# EAGLE design vfd-driver (EAGLE 8.5.0)
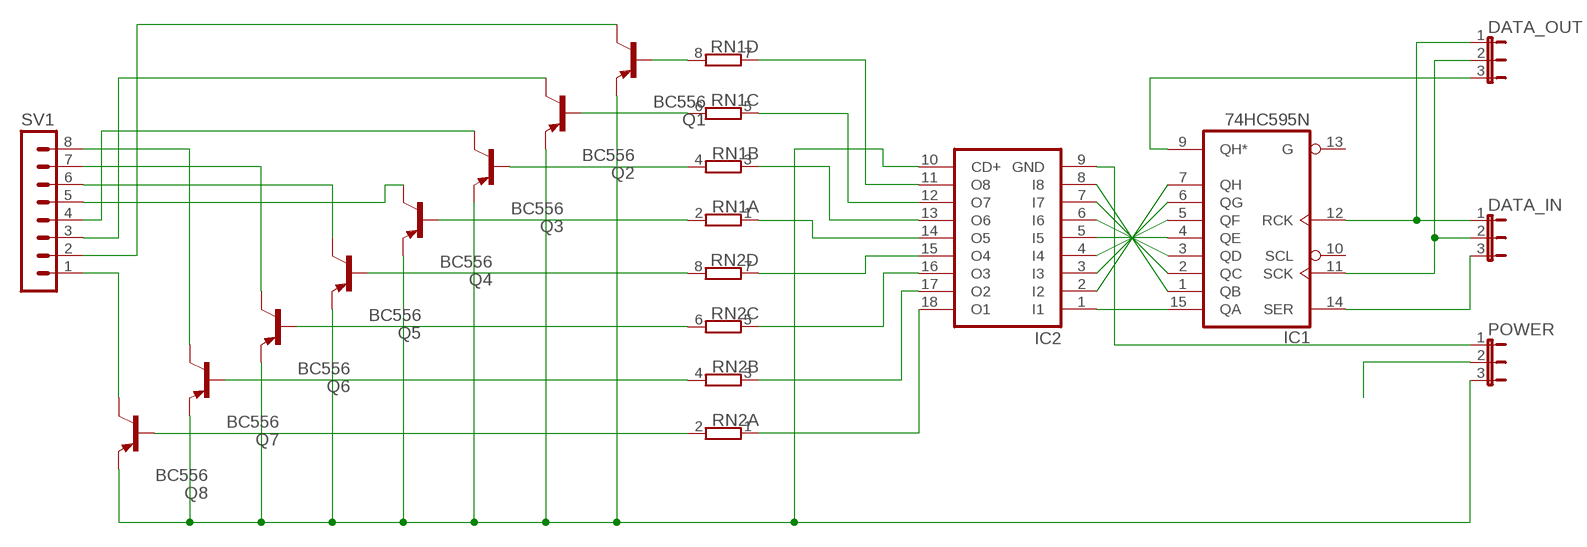
[diagram p0: schematic, sheet 1]

## Parts
DATA_IN  JP2E  [JP2]
DATA_OUT  JP2E  [JP2]
IC1  74HC595N  [DIL16]
IC2  ULN2803A  [DIL18]
POWER  JP2E  [JP2]
Q1  BC556  [TO92-EBC]
Q2  BC556  [TO92-EBC]
Q3  BC556  [TO92-EBC]
Q4  BC556  [TO92-EBC]
Q5  BC556  [TO92-EBC]
Q6  BC556  [TO92-EBC]
Q7  BC556  [TO92-EBC]
Q8  BC556  [TO92-EBC]
RN1  E4R  [SIL8]
RN2  E4R  [SIL8]
SV1  MA08-1  [MA08-1]

## Nets
DATA_IN: DATA_IN.3 IC1.14(SER)
GND: IC2.9(GND) POWER.1
N$1: Q1.B RN1.8
N$2: Q2.B RN1.6
N$3: Q3.B RN1.4
N$4: Q4.B RN1.2
N$5: Q5.B RN2.8
N$6: Q6.B RN2.6
N$7: Q7.B RN2.4
N$8: Q8.B RN2.2
N$9: IC2.18(O1) RN2.1
N$10: IC2.17(O2) RN2.3
N$11: IC2.16(O3) RN2.5
N$12: IC2.15(O4) RN2.7
N$13: IC2.11(O8) RN1.7
N$14: IC2.12(O7) RN1.5
N$15: IC2.13(O6) RN1.3
N$16: IC2.14(O5) RN1.1
N$17: IC1.1(QB) IC2.8(I8)
N$18: IC1.2(QC) IC2.7(I7)
N$19: IC1.3(QD) IC2.6(I6)
N$20: IC1.4(QE) IC2.5(I5)
N$21: IC1.5(QF) IC2.4(I4)
N$22: IC1.6(QG) IC2.3(I3)
N$23: IC1.7(QH) IC2.2(I2)
N$24: IC1.15(QA) IC2.1(I1)
N$25: Q8.C SV1.1
N$26: Q7.C SV1.8
N$27: Q6.C SV1.7
N$28: Q5.C SV1.6
N$29: Q4.C SV1.5
N$30: Q3.C SV1.4
N$31: Q2.C SV1.3
N$32: Q1.C SV1.2
N$33: DATA_IN.2 DATA_OUT.2 IC1.11(SCK)
N$34: DATA_IN.1 DATA_OUT.1 IC1.12(RCK)
N$35: DATA_OUT.3 IC1.9(QH*)
VCC: POWER.2
VSS: IC2.10(CD+) POWER.3 Q1.E Q2.E Q3.E Q4.E Q5.E Q6.E Q7.E Q8.E
Unconnected: IC1.10(SCL) IC1.13(G)

## Power pins joined to a net without a drawn wire
GND: IC1.8(GND)
VCC: IC1.16(VCC)

## Library data of the parts
DATA_IN DATA_OUT POWER = jumper:JP2E: JUMPER
IC1 = 74xx-eu:74*595: 8-bit SHIFT REGISTER, output latch
IC2 = uln-udn:ULN2803A: DRIVER ARRAY
Q1-Q8 = transistor-pnp:BC556*: PNP Transistror
RN1 RN2 = resistor-sil:E4R: SIL RESISTOR; OC_FARNELL: unknown; OC_NEWARK: unknown
SV1 = con-lstb:MA08-1: PIN HEADER; OC_FARNELL: unknown; OC_NEWARK: unknown

## Board
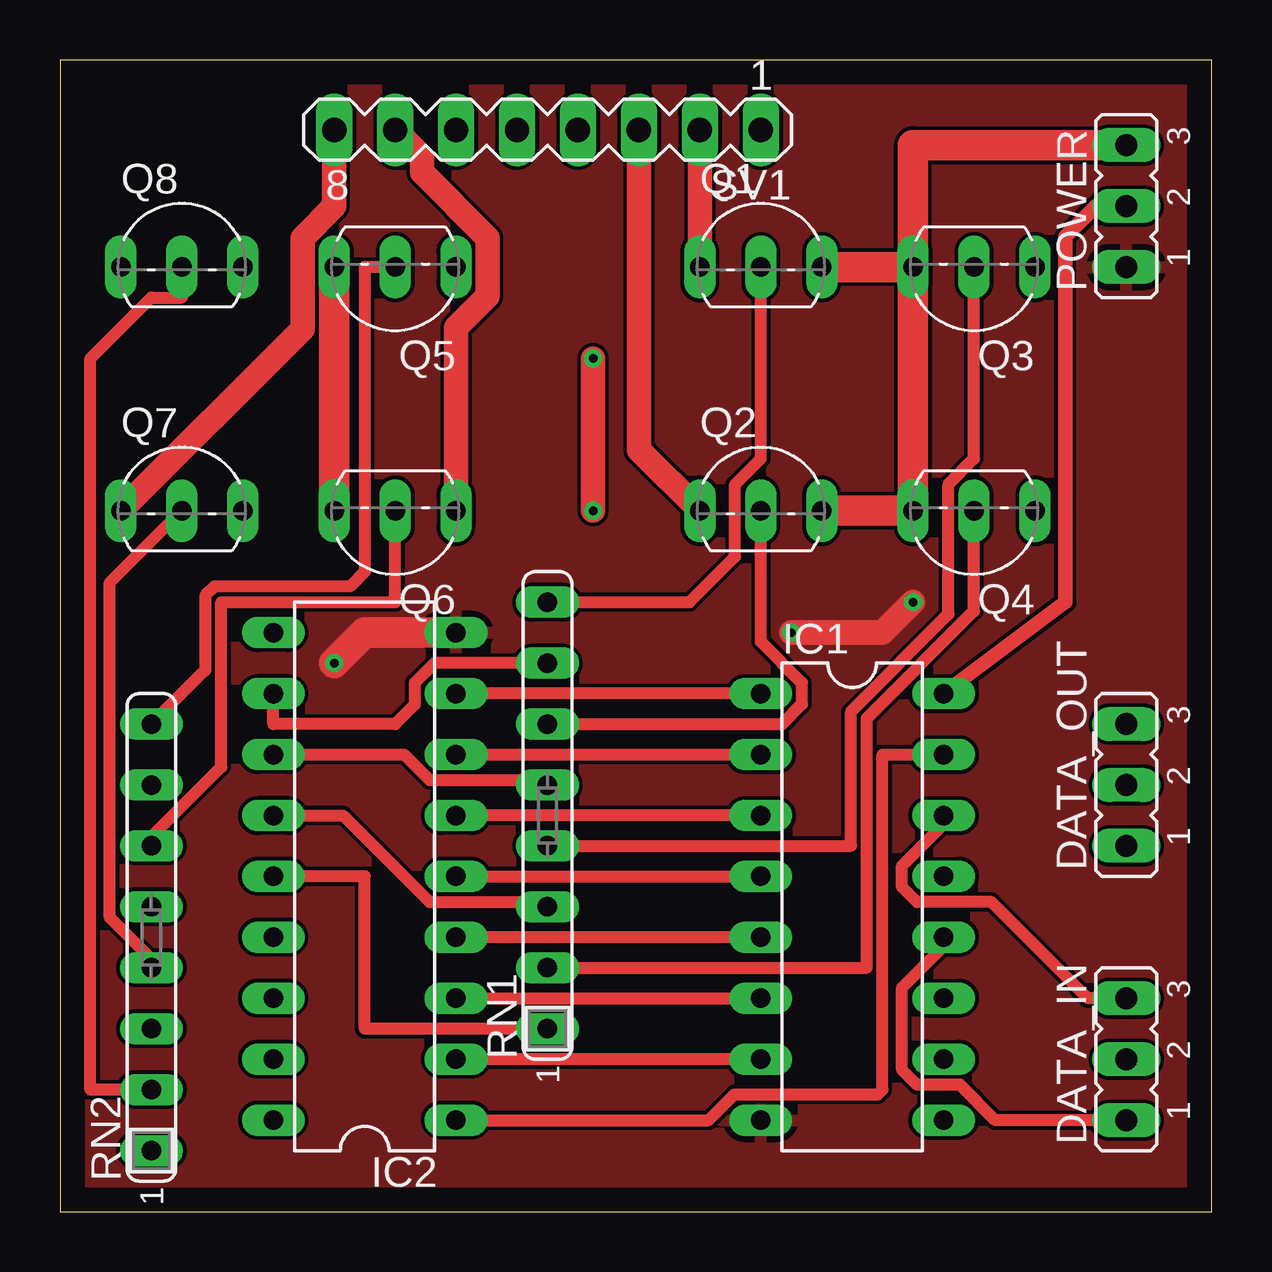
[diagram p1: board, top side]
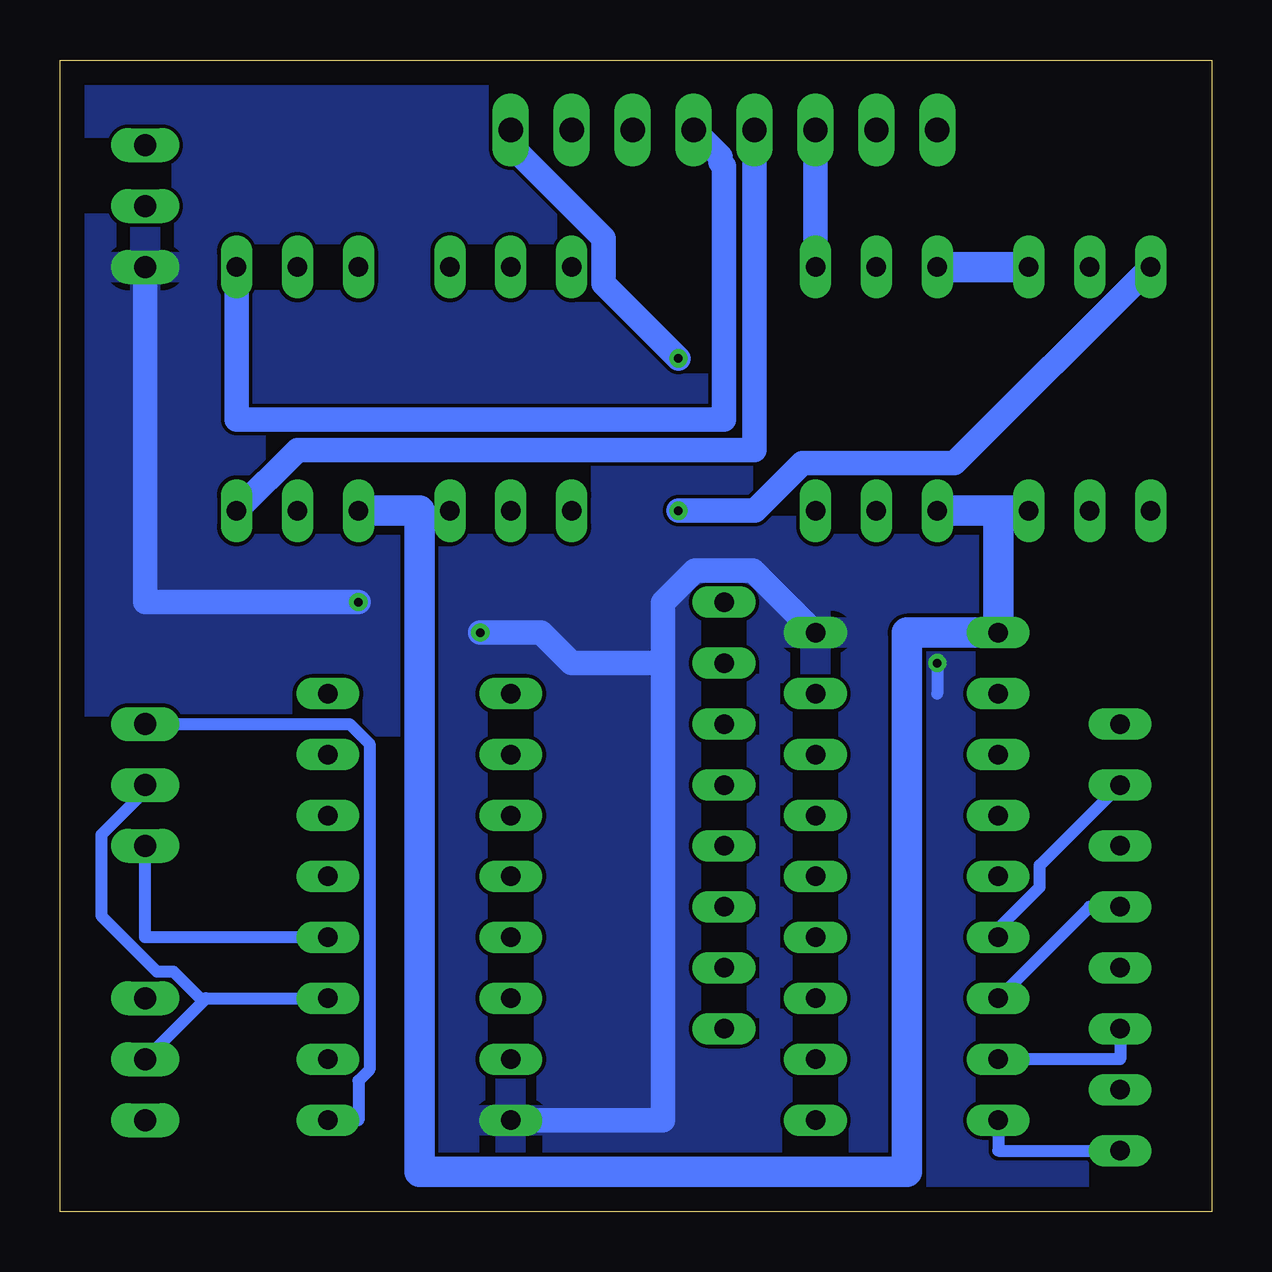
[diagram p2: board, bottom side, seen from below]

Size 48 x 48 mm. Coordinates in mm from the lower left corner, seen from the top.
Outline: 0,0 48,0 48,48 0,48 0,0
Copper layers (1*16): Top 0.035mm / dielectric 1.5mm / Bottom 0.035mm
Design rules "default": minimum track width 6mil, minimum drill 0.35mm, track to track 6mil, track to pad 6mil, pad to pad 6mil, via to via 6mil, smd to smd 6mil, copper to edge 40mil, drill to drill 6mil, minimum pad ring 10mil, minimum via ring 8mil, stop-mask expansion 4mil, vias tented up to drill 0mil, thermal gap 10mil

### Footprints (pad centres in the part's own frame; a part is rotated, then mirrored left to right if it is on the bottom)
JP2 = drill 0.914 long: 1 -2.54,0; 2 0,0; 3 2.54,0
DIL16 = drill 0.813 long: 1 -8.89,-3.81; 2 -6.35,-3.81; 3 -3.81,-3.81; 4 -1.27,-3.81; 5 1.27,-3.81; 6 3.81,-3.81; 7 6.35,-3.81; 8 8.89,-3.81; 9 8.89,3.81; 10 6.35,3.81; 11 3.81,3.81; 12 1.27,3.81; 13 -1.27,3.81; 14 -3.81,3.81; 15 -6.35,3.81; 16 -8.89,3.81
DIL18 = drill 0.813 long: 1 -10.16,-3.81; 2 -7.62,-3.81; 3 -5.08,-3.81; 4 -2.54,-3.81; 5 0,-3.81; 6 2.54,-3.81; 7 5.08,-3.81; 8 7.62,-3.81; 9 10.16,-3.81; 10 10.16,3.81; 11 7.62,3.81; 12 5.08,3.81; 13 2.54,3.81; 14 0,3.81; 15 -2.54,3.81; 16 -5.08,3.81; 17 -7.62,3.81; 18 -10.16,3.81
TO92-EBC = drill 0.813 long: B 0,-1.27; C -2.54,-1.27; E 2.54,-1.27
SIL8 = drill 0.813 long: 1 -8.89,0; 2 -6.35,0; 3 -3.81,0; 4 -1.27,0; 5 1.27,0; 6 3.81,0; 7 6.35,0; 8 8.89,0
MA08-1 = drill 1.016 long: 1 -8.89,0; 2 -6.35,0; 3 -3.81,0; 4 -1.27,0; 5 1.27,0; 6 3.81,0; 7 6.35,0; 8 8.89,0

### Placement (x,y rotation side)
DATA_IN  44.45,6.35 90 top
DATA_OUT  44.45,17.78 90 top
IC1  33.02,12.7 270 top
IC2  12.7,13.97 90 top
POWER  44.45,41.91 90 top
Q1  29.21,40.64 0 top
Q2  29.21,30.48 0 top
Q3  38.1,38.1 180 top
Q4  38.1,27.94 180 top
Q5  13.97,38.1 180 top
Q6  13.97,27.94 180 top
Q7  5.08,30.48 0 top
Q8  5.08,40.64 0 top
RN1  20.32,16.51 90 top
RN2  3.81,11.43 90 top
SV1  20.32,45.09 180 top

### Tracks (layer width: path | path; a pad name or v marks a point on that pad's centre or on a via)
DATA_IN
  Top 0.508: DATA_IN.3 42.84,8.89 38.83,12.9 35.73,12.9 35.1,13.53 35.1,14.41 36.83,16.14 IC1.14
GND  (via drill 0.35)
  Top 1.016: v30.48,24.13 34.29,24.13 v35.56,25.4
  Top 1.27: IC2.9 12.7,24.13 v11.43,22.86
  Bottom 0.508: v11.43,22.86 11.43,21.59
  Bottom 1.016: 22.86,22.86 22.86,25.39 21.53,26.72 19.11,26.72 16.52,24.13 IC2.9 | 22.86,22.86 22.86,3.81 IC1.8 | 22.86,22.86 26.67,22.86 27.94,24.13 v30.48,24.13 | v35.56,25.4 44.45,25.4 POWER.1
  pour Bottom: -1.27,48.26 -1.27,-1.27 49.53,-1.27 49.53,49.53 -1.27,49.53
  pour Top: -2.54,50.8 50.8,50.8 50.8,48.26 50.8,-2.54 -2.54,-2.54 -2.54,-1.27
N$1
  Top 0.508: RN1.8 26.25,25.4 28.14,27.3 28.14,30.31 29.21,31.38 Q1.B
N$2
  Top 0.508: Q2.B 29.21,23.76 30.94,22.03 30.94,21.15 30.11,20.32 RN1.6
N$3
  Top 0.508: RN1.4 32.97,15.24 32.97,20.83 37.03,24.9 37.03,30.31 38.1,31.38 Q3.B
N$4
  Top 0.508: RN1.2 33.63,10.16 33.63,20.56 38.1,25.03 Q4.B
N$5
  Top 0.508: Q5.B 12.7,39.37 12.7,26.67 12.09,26.06 6.45,26.06 6.06,25.67 6.06,22.57 RN2.8
N$6
  Top 0.508: RN2.6 3.81,15.61 6.72,18.52 6.72,25.4 13.97,25.4 Q6.B
N$7
  Top 0.508: RN2.4 3.81,10.53 2.08,12.26 2.08,26.21 Q7.B
N$8
  Top 0.508: RN2.2 1.27,5.08 1.27,35.56 3.81,38.1 5.08,38.1 Q8.B
N$9
  Bottom 0.508: IC2.18 8.89,2.54 RN2.1
N$10
  Bottom 0.508: RN2.3 3.81,6.35 IC2.17
N$11
  Bottom 0.508: IC2.16 5.08,12.7 RN2.5
N$12
  Bottom 0.508: IC2.15 8.89,11.8 7.16,13.53 7.16,14.43 RN2.7
N$13
  Top 0.508: RN1.7 15.61,22.86 14.78,22.03 14.78,21.13 13.97,20.32 8.89,20.32 IC2.11
N$14
  Top 0.508: IC2.12 14.34,19.05 15.41,17.98 20.12,17.98 RN1.5
N$15
  Top 0.508: RN1.3 20.12,12.9 15.41,12.9 11.8,16.51 IC2.13
N$16
  Top 0.508: RN1.1 12.7,7.62 12.7,13.97 IC2.14
N$17
  Top 0.508: IC1.1 IC2.8
N$18
  Top 0.508: IC2.7 IC1.2
N$19
  Top 0.508: IC1.3 IC2.6
N$20
  Top 0.508: IC2.5 IC1.4
N$21
  Top 0.508: IC1.5 IC2.4
N$22
  Top 0.508: IC2.3 IC1.6
N$23
  Top 0.508: IC1.7 IC2.2
N$24
  Top 0.508: IC2.1 27.04,3.81 28.11,4.88 34.09,4.88 34.29,5.08 34.29,19.05 IC1.15
N$25  (via drill 0.35)
  Top 1.016: v22.23,29.21 v22.23,35.56
  Bottom 1.016: Q8.C 10.72,31.19 17.06,31.19 19.04,29.21 v22.23,29.21 | v22.23,35.56 25.35,38.68 25.35,40.58 29.21,44.44 SV1.1
N$26
  Top 1.016: Q7.C 10.11,36.78 10.11,40.58 11.43,41.9 SV1.8
N$27
  Top 1.016: SV1.7 15.09,43.97 15.09,43.32 17.83,40.58 17.83,38.16 16.51,36.84 Q6.C
N$28
  Bottom 1.016: Q5.C SV1.6
N$29
  Bottom 1.016: Q4.C 38.1,31.75 19.05,31.75 SV1.5
N$30
  Bottom 1.016: Q3.C 40.64,33.02 20.32,33.02 20.32,43.58 20.47,43.73 20.47,43.97 SV1.4
N$31
  Top 1.016: SV1.3 24.13,31.75 Q2.C
N$32
  Top 1.016: Q1.C SV1.2
N$33
  Bottom 0.508: DATA_IN.2 41.91,8.89 | 41.91,8.89 IC1.11 | DATA_OUT.2 44.45,17.53 46.28,15.7 46.28,12.32 43.96,10.01 43.28,10.01 42.16,8.89 41.91,8.89
N$34
  Top 0.508: DATA_IN.1 39,3.81 37.53,5.28 35.73,5.28 35.1,5.91 35.1,9.33 36.83,11.06 IC1.12
  Bottom 0.508: IC1.12 44.45,11.43 DATA_OUT.1
N$35
  Bottom 0.508: DATA_OUT.3 35.93,20.32 35.1,19.49 35.1,5.91 35.56,5.45 35.56,3.81 IC1.9
VCC
  Top 0.61: IC1.16 41.91,25.4 41.91,40.64 43.18,41.91 POWER.2
VSS
  Top 1.27: Q3.E Q4.E Q2.E | Q3.E Q1.E | Q3.E 35.56,44.45 POWER.3 | Q6.E Q5.E
  Bottom 1.27: Q4.E 33.02,29.21 33.02,1.65 12.7,1.65 12.7,24.13 IC2.10 8.89,29.21 Q7.E Q6.E | Q5.E Q8.E